# Altium schematic sheet 02-CPU_BOARD.SchDoc
size B
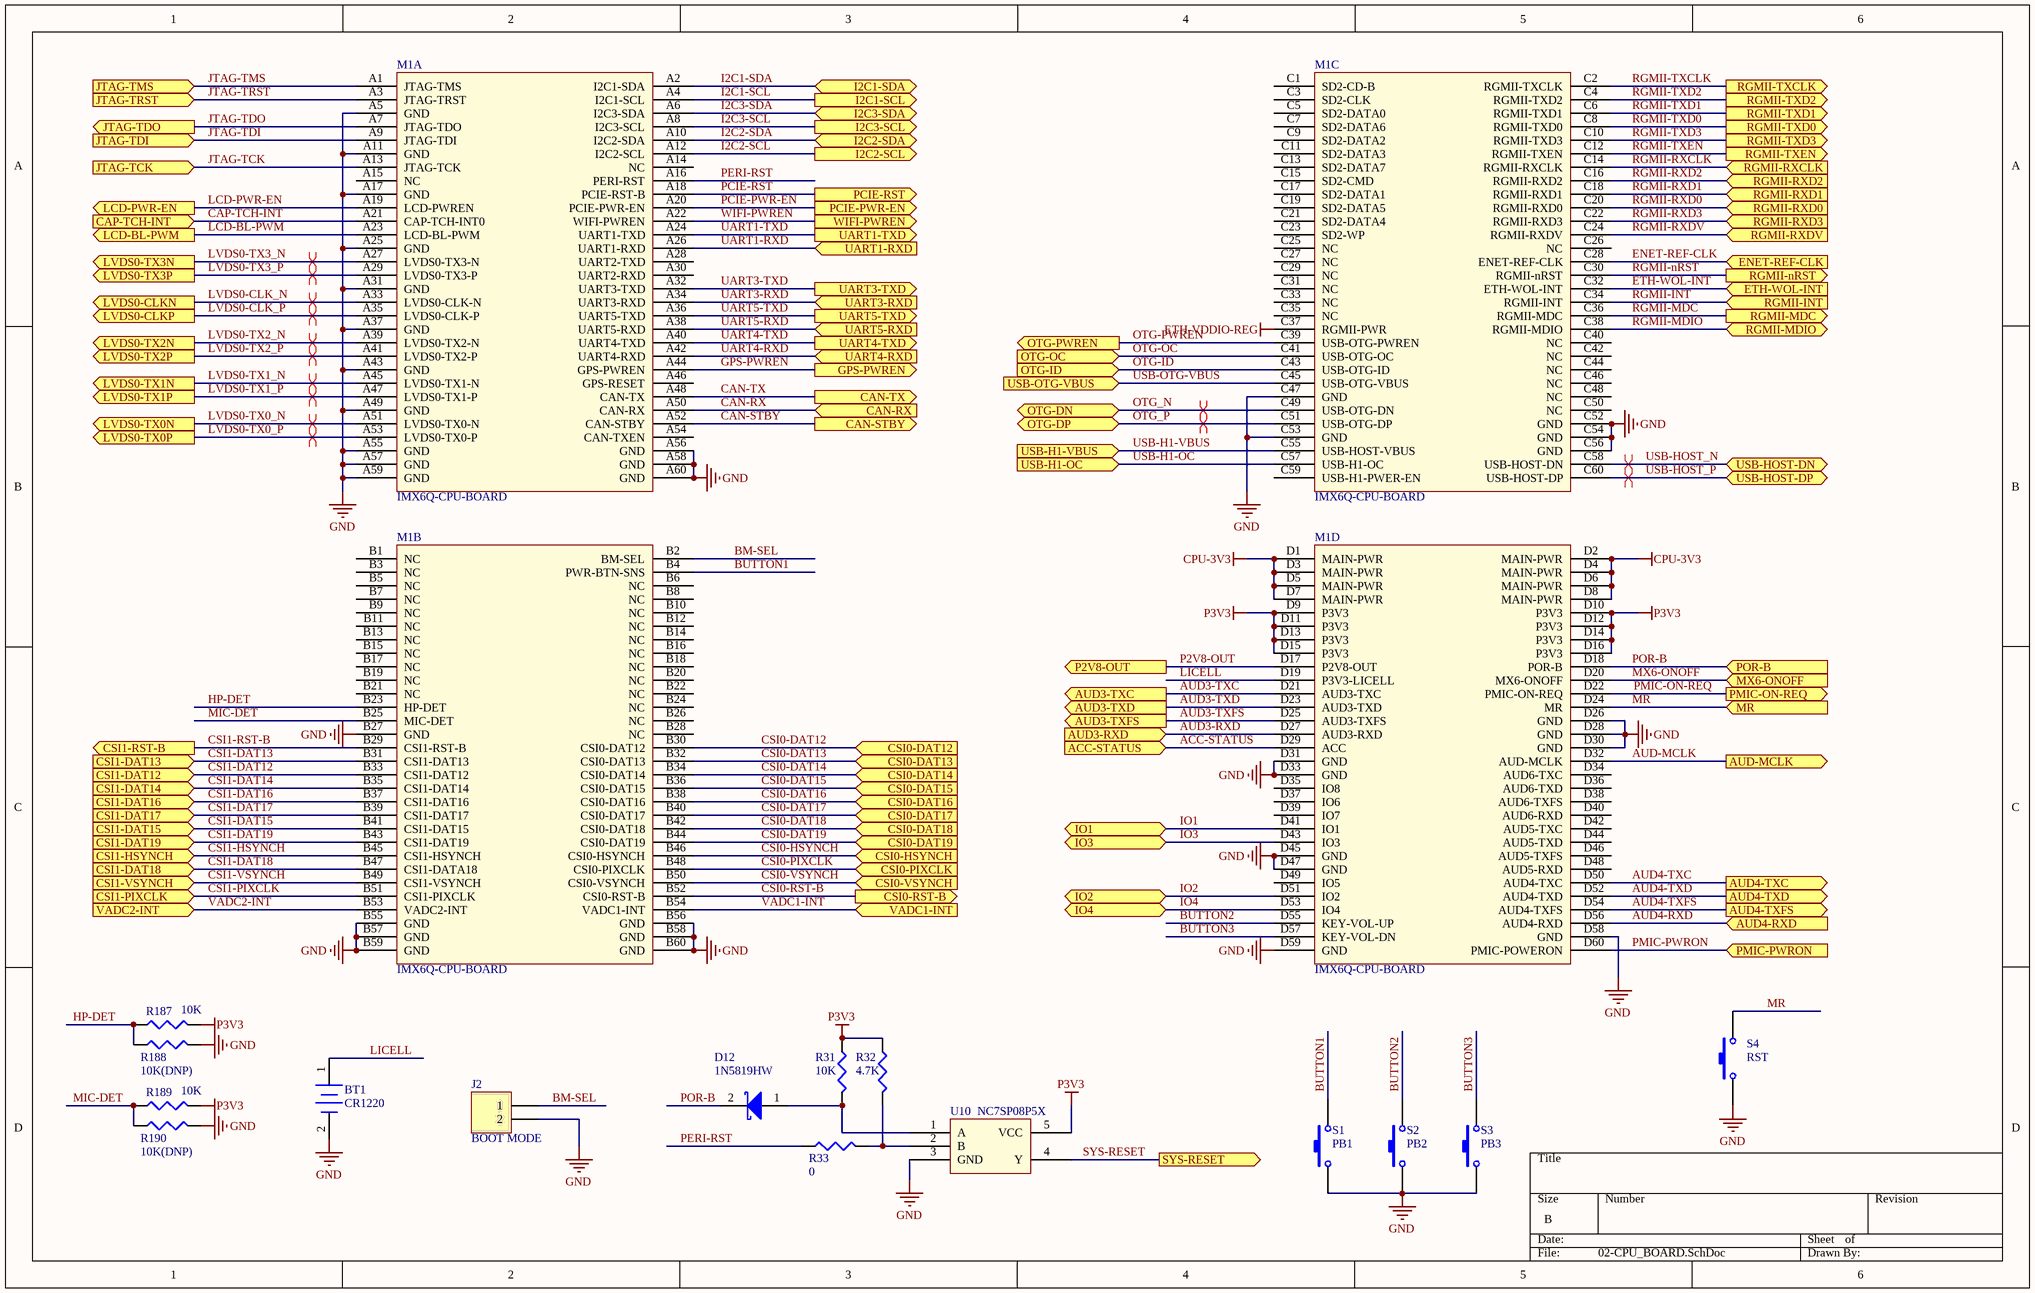
[diagram p0: 02-CPU_BOARD.SchDoc]

## Parts
BT1  CR1220  [cr1220]
D12  1N5819HW  [1N5819]
J2  BOOT MODE  [HDR1X2]
M1  IMX6Q-CPU-BOARD  (parts A,B,C,D of 4)
R31  10K  [0402]
R32  4.7K  [0402]
R33  0  [0402]
R187  10K  [0402]
R188  10K(DNP)  [0402]
R189  10K  [0402]
R190  10K(DNP)  [0402]
S1  PB1  [SW-PB-SMD]
S2  PB2  [SW-PB-SMD]
S3  PB3  [SW-PB-SMD]
S4  RST  [SW-PB-SMD]
U10  NC7SP08P5X  [SC70]

## Ports
ACC-STATUS (in), AUD3-RXD (in), AUD3-TXC (out), AUD3-TXD (out), AUD3-TXFS (out), AUD4-RXD (in), AUD4-TXC (out), AUD4-TXD (out), AUD4-TXFS (out), AUD-MCLK (out), CAN-RX (in), CAN-STBY (out), CAN-TX (out), CAP-TCH-INT (in), CSI0-DAT12 (in), CSI0-DAT13 (in), CSI0-DAT14 (in), CSI0-DAT15 (in), CSI0-DAT16 (in), CSI0-DAT17 (in), CSI0-DAT18 (in), CSI0-DAT19 (in), CSI0-HSYNCH (in), CSI0-PIXCLK (in), CSI0-RST-B (out), CSI0-VSYNCH (in), CSI1-DAT12 (in), CSI1-DAT13 (in), CSI1-DAT14 (in), CSI1-DAT15 (in), CSI1-DAT16 (in), CSI1-DAT17 (in), CSI1-DAT18 (in), CSI1-DAT19 (in), CSI1-HSYNCH (in), CSI1-PIXCLK (in), CSI1-RST-B (out), CSI1-VSYNCH (in), ENET-REF-CLK (in), ETH-WOL-INT (in), GPS-PWREN (out), I2C1-SCL (out), I2C1-SDA (bidir), I2C2-SCL (out), I2C2-SDA (bidir), I2C3-SCL (out), I2C3-SDA (bidir), IO1 (bidir), IO2 (bidir), IO3 (bidir), IO4 (bidir), JTAG-TCK (in), JTAG-TDI (in), JTAG-TDO (out), JTAG-TMS (in), JTAG-TRST (in), LCD-BL-PWM (out), LCD-PWR-EN (out), LVDS0-CLKN (out), LVDS0-CLKP (out), LVDS0-TX0N (out), LVDS0-TX0P (out), LVDS0-TX1N (out), LVDS0-TX1P (out), LVDS0-TX2N (out), LVDS0-TX2P (out), LVDS0-TX3N (out), LVDS0-TX3P (out), MR (in), MX6-ONOFF (in), OTG-DN, OTG-DP (bidir), OTG-ID (in), OTG-OC (in), OTG-PWREN (out), P2V8-OUT (out), PCIE-PWR-EN (out), PCIE-RST (out), PMIC-ON-REQ (out), PMIC-PWRON (in), POR-B (in), RGMII-INT (in), RGMII-MDC (out), RGMII-MDIO (bidir), RGMII-nRST (out), RGMII-RXCLK (in), RGMII-RXD0 (in), RGMII-RXD1 (in), RGMII-RXD2 (in), RGMII-RXD3 (in), RGMII-RXDV (in), RGMII-TXCLK (out), RGMII-TXD0 (out), RGMII-TXD1 (out), RGMII-TXD2 (out), RGMII-TXD3 (out), RGMII-TXEN (out), SYS-RESET (out), UART1-RXD (in), UART1-TXD (out), UART3-RXD (in), UART3-TXD (out), UART4-RXD (in), UART4-TXD (out), UART5-RXD (in), UART5-TXD (out), USB-H1-OC (in), USB-H1-VBUS (in), USB-HOST-DN (bidir), USB-HOST-DP (bidir), USB-OTG-VBUS (in), VADC1-INT (in), VADC2-INT (in), WIFI-PWREN (out)

## Nets
CPU-3V3: M1.D1(MAIN-PWR) M1.D2(MAIN-PWR) M1.D3(MAIN-PWR) M1.D4(MAIN-PWR) M1.D5(MAIN-PWR) M1.D6(MAIN-PWR) M1.D7(MAIN-PWR) M1.D8(MAIN-PWR)
ETH-VDDIO-REG: M1.C37(RGMII-PWR)
GND: BT1.2(-) J2.2 M1.A5(GND) M1.A11(GND) M1.A17(GND) M1.A25(GND) M1.A31(GND) M1.A37(GND) M1.A43(GND) M1.A49(GND) M1.A55(GND) M1.A56(GND) M1.A57(GND) M1.A58(GND) M1.A59(GND) M1.A60(GND) M1.B27(GND) M1.B55(GND) M1.B56(GND) M1.B57(GND) M1.B58(GND) M1.B59(GND) M1.B60(GND) M1.C47(GND) M1.C52(GND) M1.C53(GND) M1.C54(GND) M1.C56(GND) M1.D26(GND) M1.D28(GND) M1.D30(GND) M1.D31(GND) M1.D33(GND) M1.D45(GND) M1.D47(GND) M1.D58(GND) M1.D59(GND) R188.2 R190.2 S1.1 S2.1 S3.1 S4.1 U10.3(GND)
P3V3: M1.D9(P3V3) M1.D10(P3V3) M1.D11(P3V3) M1.D12(P3V3) M1.D13(P3V3) M1.D14(P3V3) M1.D15(P3V3) M1.D16(P3V3) R31.1 R32.1 R187.2 R189.2 U10.5(VCC)
ACC-STATUS: M1.D29(ACC) ; port ACC-STATUS
AUD3-RXD: M1.D27(AUD3-RXD) ; port AUD3-RXD
AUD3-TXC: M1.D21(AUD3-TXC) ; port AUD3-TXC
AUD3-TXD: M1.D23(AUD3-TXD) ; port AUD3-TXD
AUD3-TXFS: M1.D25(AUD3-TXFS) ; port AUD3-TXFS
AUD4-RXD: M1.D56(AUD4-RXD) ; port AUD4-RXD
AUD4-TXC: M1.D50(AUD4-TXC) ; port AUD4-TXC
AUD4-TXD: M1.D52(AUD4-TXD) ; port AUD4-TXD
AUD4-TXFS: M1.D54(AUD4-TXFS) ; port AUD4-TXFS
AUD-MCLK: M1.D32(AUD-MCLK) ; port AUD-MCLK
BM-SEL: J2.1 M1.B2(BM-SEL)
BUTTON1: M1.B4(PWR-BTN-SNS) S1.2
BUTTON2: M1.D55(KEY-VOL-UP) S2.2
BUTTON3: M1.D57(KEY-VOL-DN) S3.2
CAN-RX: M1.A50(CAN-RX) ; port CAN-RX
CAN-STBY: M1.A52(CAN-STBY) ; port CAN-STBY
CAN-TX: M1.A48(CAN-TX) ; port CAN-TX
CAP-TCH-INT: M1.A21(CAP-TCH-INT0) ; port CAP-TCH-INT
CSI0-DAT12: M1.B30(CSI0-DAT12) ; port CSI0-DAT12
CSI0-DAT13: M1.B32(CSI0-DAT13) ; port CSI0-DAT13
CSI0-DAT14: M1.B34(CSI0-DAT14) ; port CSI0-DAT14
CSI0-DAT15: M1.B36(CSI0-DAT15) ; port CSI0-DAT15
CSI0-DAT16: M1.B38(CSI0-DAT16) ; port CSI0-DAT16
CSI0-DAT17: M1.B40(CSI0-DAT17) ; port CSI0-DAT17
CSI0-DAT18: M1.B42(CSI0-DAT18) ; port CSI0-DAT18
CSI0-DAT19: M1.B44(CSI0-DAT19) ; port CSI0-DAT19
CSI0-HSYNCH: M1.B46(CSI0-HSYNCH) ; port CSI0-HSYNCH
CSI0-PIXCLK: M1.B48(CSI0-PIXCLK) ; port CSI0-PIXCLK
CSI0-RST-B: M1.B52(CSI0-RST-B) ; port CSI0-RST-B
CSI0-VSYNCH: M1.B50(CSI0-VSYNCH) ; port CSI0-VSYNCH
CSI1-DAT12: M1.B33(CSI1-DAT12) ; port CSI1-DAT12
CSI1-DAT13: M1.B31(CSI1-DAT13) ; port CSI1-DAT13
CSI1-DAT14: M1.B35(CSI1-DAT14) ; port CSI1-DAT14
CSI1-DAT15: M1.B41(CSI1-DAT15) ; port CSI1-DAT15
CSI1-DAT16: M1.B37(CSI1-DAT16) ; port CSI1-DAT16
CSI1-DAT17: M1.B39(CSI1-DAT17) ; port CSI1-DAT17
CSI1-DAT18: M1.B47(CSI1-DATA18) ; port CSI1-DAT18
CSI1-DAT19: M1.B43(CSI1-DAT19) ; port CSI1-DAT19
CSI1-HSYNCH: M1.B45(CSI1-HSYNCH) ; port CSI1-HSYNCH
CSI1-PIXCLK: M1.B51(CSI1-PIXCLK) ; port CSI1-PIXCLK
CSI1-RST-B: M1.B29(CSI1-RST-B) ; port CSI1-RST-B
CSI1-VSYNCH: M1.B49(CSI1-VSYNCH) ; port CSI1-VSYNCH
ENET-REF-CLK: M1.C28(ENET-REF-CLK) ; port ENET-REF-CLK
ETH-WOL-INT: M1.C32(ETH-WOL-INT) ; port ETH-WOL-INT
GPS-PWREN: M1.A44(GPS-PWREN) ; port GPS-PWREN
HP-DET: M1.B23(HP-DET) R187.1 R188.1
I2C1-SCL: M1.A4(I2C1-SCL) ; port I2C1-SCL
I2C1-SDA: M1.A2(I2C1-SDA) ; port I2C1-SDA
I2C2-SCL: M1.A12(I2C2-SCL) ; port I2C2-SCL
I2C2-SDA: M1.A10(I2C2-SDA) ; port I2C2-SDA
I2C3-SCL: M1.A8(I2C3-SCL) ; port I2C3-SCL
I2C3-SDA: M1.A6(I2C3-SDA) ; port I2C3-SDA
IO1: M1.D41(IO1) ; port IO1
IO2: M1.D51(IO2) ; port IO2
IO3: M1.D43(IO3) ; port IO3
IO4: M1.D53(IO4) ; port IO4
JTAG-TCK: M1.A13(JTAG-TCK) ; port JTAG-TCK
JTAG-TDI: M1.A9(JTAG-TDI) ; port JTAG-TDI
JTAG-TDO: M1.A7(JTAG-TDO) ; port JTAG-TDO
JTAG-TMS: M1.A1(JTAG-TMS) ; port JTAG-TMS
JTAG-TRST: M1.A3(JTAG-TRST) ; port JTAG-TRST
LCD-BL-PWM: M1.A23(LCD-BL-PWM) ; port LCD-BL-PWM
LCD-PWR-EN: M1.A19(LCD-PWREN) ; port LCD-PWR-EN
LICELL: BT1.1(+) M1.D19(P3V3-LICELL)
LVDS0-CLK_N: M1.A33(LVDS0-CLK-N) ; port LVDS0-CLKN
LVDS0-CLK_P: M1.A35(LVDS0-CLK-P) ; port LVDS0-CLKP
LVDS0-TX0_N: M1.A51(LVDS0-TX0-N) ; port LVDS0-TX0N
LVDS0-TX0_P: M1.A53(LVDS0-TX0-P) ; port LVDS0-TX0P
LVDS0-TX1_N: M1.A45(LVDS0-TX1-N) ; port LVDS0-TX1N
LVDS0-TX1_P: M1.A47(LVDS0-TX1-P) ; port LVDS0-TX1P
LVDS0-TX2_N: M1.A39(LVDS0-TX2-N) ; port LVDS0-TX2N
LVDS0-TX2_P: M1.A41(LVDS0-TX2-P) ; port LVDS0-TX2P
LVDS0-TX3_N: M1.A27(LVDS0-TX3-N) ; port LVDS0-TX3N
LVDS0-TX3_P: M1.A29(LVDS0-TX3-P) ; port LVDS0-TX3P
MIC-DET: M1.B25(MIC-DET) R189.1 R190.1
MR: M1.D24(MR) S4.2 ; port MR
MX6-ONOFF: M1.D20(MX6-ONOFF) ; port MX6-ONOFF
OTG-ID: M1.C43(USB-OTG-ID) ; port OTG-ID
OTG-OC: M1.C41(USB-OTG-OC) ; port OTG-OC
OTG-PWREN: M1.C39(USB-OTG-PWREN) ; port OTG-PWREN
OTG_N: M1.C49(USB-OTG-DN) ; port OTG-DN
OTG_P: M1.C51(USB-OTG-DP) ; port OTG-DP
P2V8-OUT: M1.D17(P2V8-OUT) ; port P2V8-OUT
PCIE-PWR-EN: M1.A20(PCIE-PWR-EN) ; port PCIE-PWR-EN
PCIE-RST: M1.A18(PCIE-RST-B) ; port PCIE-RST
PERI-RST: M1.A16(PERI-RST) R33.1
PMIC-ON-REQ: M1.D22(PMIC-ON-REQ) ; port PMIC-ON-REQ
PMIC-PWRON: M1.D60(PMIC-POWERON) ; port PMIC-PWRON
POR-B: D12.2(K) M1.D18(POR-B) ; port POR-B
RGMII-INT: M1.C34(RGMII-INT) ; port RGMII-INT
RGMII-MDC: M1.C36(RGMII-MDC) ; port RGMII-MDC
RGMII-MDIO: M1.C38(RGMII-MDIO) ; port RGMII-MDIO
RGMII-nRST: M1.C30(RGMII-nRST) ; port RGMII-nRST
RGMII-RXCLK: M1.C14(RGMII-RXCLK) ; port RGMII-RXCLK
RGMII-RXD0: M1.C20(RGMII-RXD0) ; port RGMII-RXD0
RGMII-RXD1: M1.C18(RGMII-RXD1) ; port RGMII-RXD1
RGMII-RXD2: M1.C16(RGMII-RXD2) ; port RGMII-RXD2
RGMII-RXD3: M1.C22(RGMII-RXD3) ; port RGMII-RXD3
RGMII-RXDV: M1.C24(RGMII-RXDV) ; port RGMII-RXDV
RGMII-TXCLK: M1.C2(RGMII-TXCLK) ; port RGMII-TXCLK
RGMII-TXD0: M1.C8(RGMII-TXD0) ; port RGMII-TXD0
RGMII-TXD1: M1.C6(RGMII-TXD1) ; port RGMII-TXD1
RGMII-TXD2: M1.C4(RGMII-TXD2) ; port RGMII-TXD2
RGMII-TXD3: M1.C10(RGMII-TXD3) ; port RGMII-TXD3
RGMII-TXEN: M1.C12(RGMII-TXEN) ; port RGMII-TXEN
SYS-RESET: U10.4(Y) ; port SYS-RESET
UART1-RXD: M1.A26(UART1-RXD) ; port UART1-RXD
UART1-TXD: M1.A24(UART1-TXD) ; port UART1-TXD
UART3-RXD: M1.A34(UART3-RXD) ; port UART3-RXD
UART3-TXD: M1.A32(UART3-TXD) ; port UART3-TXD
UART4-RXD: M1.A42(UART4-RXD) ; port UART4-RXD
UART4-TXD: M1.A40(UART4-TXD) ; port UART4-TXD
UART5-RXD: M1.A38(UART5-RXD) ; port UART5-RXD
UART5-TXD: M1.A36(UART5-TXD) ; port UART5-TXD
USB-H1-OC: M1.C57(USB-H1-OC) ; port USB-H1-OC
USB-H1-VBUS: M1.C55(USB-HOST-VBUS) ; port USB-H1-VBUS
USB-HOST_N: M1.C58(USB-HOST-DN) ; port USB-HOST-DN
USB-HOST_P: M1.C60(USB-HOST-DP) ; port USB-HOST-DP
USB-OTG-VBUS: M1.C45(USB-OTG-VBUS) ; port USB-OTG-VBUS
VADC1-INT: M1.B54(VADC1-INT) ; port VADC1-INT
VADC2-INT: M1.B53(VADC2-INT) ; port VADC2-INT
WIFI-PWREN: M1.A22(WIFI-PWREN) ; port WIFI-PWREN
NetD12_1: D12.1(A) R31.2 U10.1(A)
NetR32_2: R32.2 R33.2 U10.2(B)

Not connected (* = marked no-connect by the designer): M1 A14(NC) A15(NC) A28(UART2-TXD) A30(UART2-RXD) A46(GPS-RESET) A54(CAN-TXEN) B1(NC) B3(NC) B5(NC) B6(NC) B7(NC) B8(NC) B9(NC) B10(NC) B11(NC) B12(NC) B13(NC) B14(NC) B15(NC) B16(NC) B17(NC) B18(NC) B19(NC) B20(NC) B21(NC) B22(NC) B24(NC) B26(NC) B28(NC) C1(SD2-CD-B) C3(SD2-CLK) C5(SD2-DATA0) C7(SD2-DATA6) C9(SD2-DATA2) C11(SD2-DATA3) C13(SD2-DATA7) C15(SD2-CMD) C17(SD2-DATA1) C19(SD2-DATA5) C21(SD2-DATA4) C23(SD2-WP) C25(NC) C26(NC) C27(NC) C29(NC) C31(NC) C33(NC) C35(NC) C40(NC) C42(NC) C44(NC) C46(NC) C48(NC) C50(NC) C59(USB-H1-PWER-EN) D34(AUD6-TXC) D35(IO8) D36(AUD6-TXD) D37(IO6) D38(AUD6-TXFS) D39(IO7) D40(AUD6-RXD) D42(AUD5-TXC) D44(AUD5-TXD) D46(AUD5-TXFS) D48(AUD5-RXD) D49(IO5)

## Layout directives
differential pair: LVDS0-CLK_N, LVDS0-CLK_P, LVDS0-TX0_N, LVDS0-TX0_P, LVDS0-TX1_N, LVDS0-TX1_P, LVDS0-TX2_N, LVDS0-TX2_P, LVDS0-TX3_N, LVDS0-TX3_P, OTG_N, OTG_P, USB-HOST_N, USB-HOST_P

## Library data of the parts
BT1 = Battery: Multicell Battery; Published: 24-Mar-1999; LatestRevisionDate: 17-Jul-2002; LatestRevisionNote: Re-released for DXP Platform.; PackageReference: BAT-2; Publisher: Altium Limited; PackageDescription: Battery; 2 Leads
D12 = Diode 11DQ03: Schottky Rectifier
J2 = Header 2: Header, 2-Pin; LatestRevisionDate: 17-Jul-2002; LatestRevisionNote: Re-released for DXP Platform.; Publisher: Altium Limited
R31-R33 R187-R190 = CR16-1003FM
S1-S4 = SW-PB: Switch; Published: 24-Mar-1999; LatestRevisionDate: 17-Jul-2002; LatestRevisionNote: Re-released for DXP Platform.; PackageReference: SPST-2; Publisher: Altium Limited; PackageDescription: Switch; 2 Leads